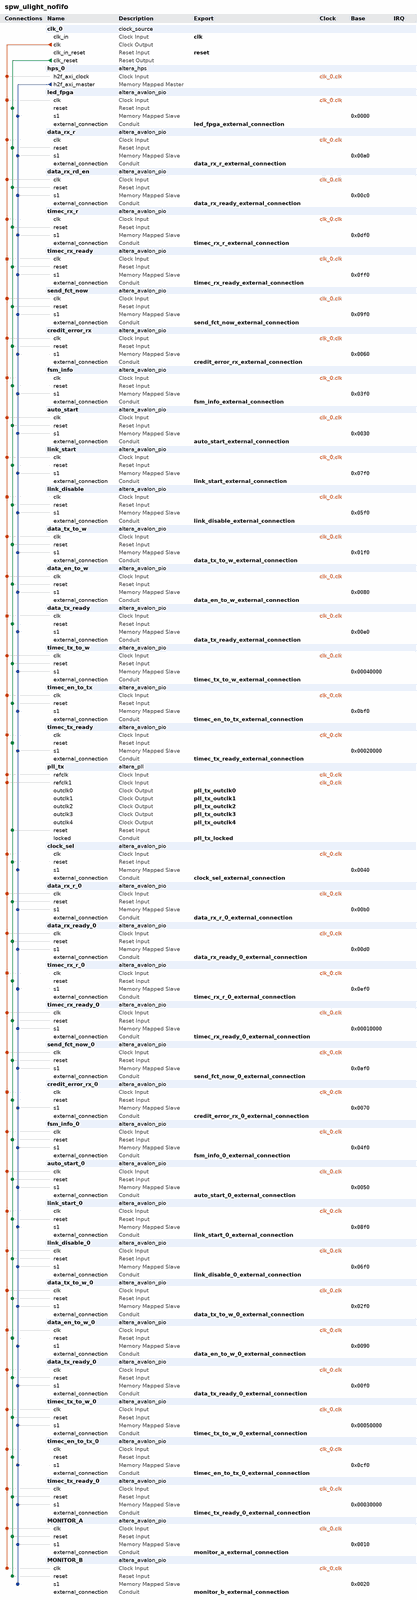
[diagram p0: system contents, whole]
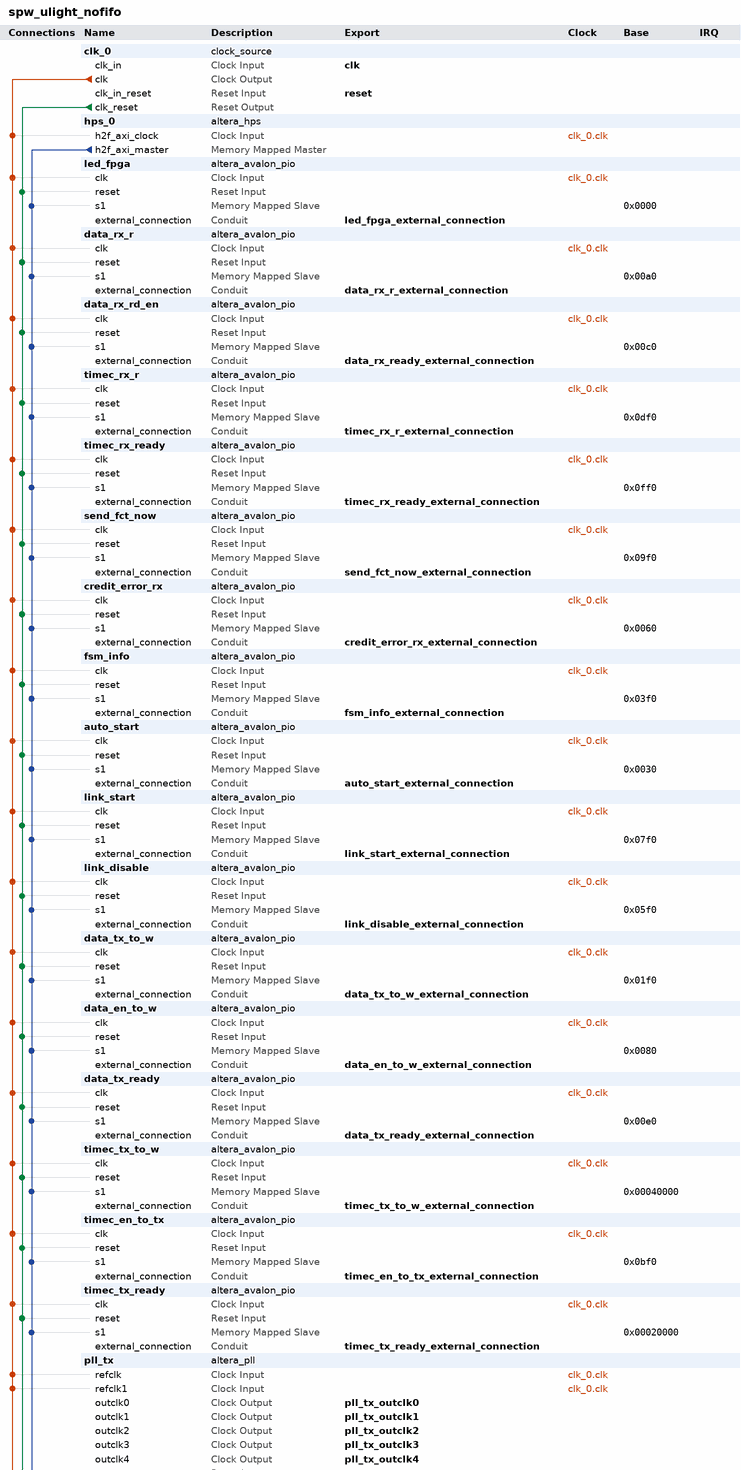
[diagram p1: system contents, upper part]
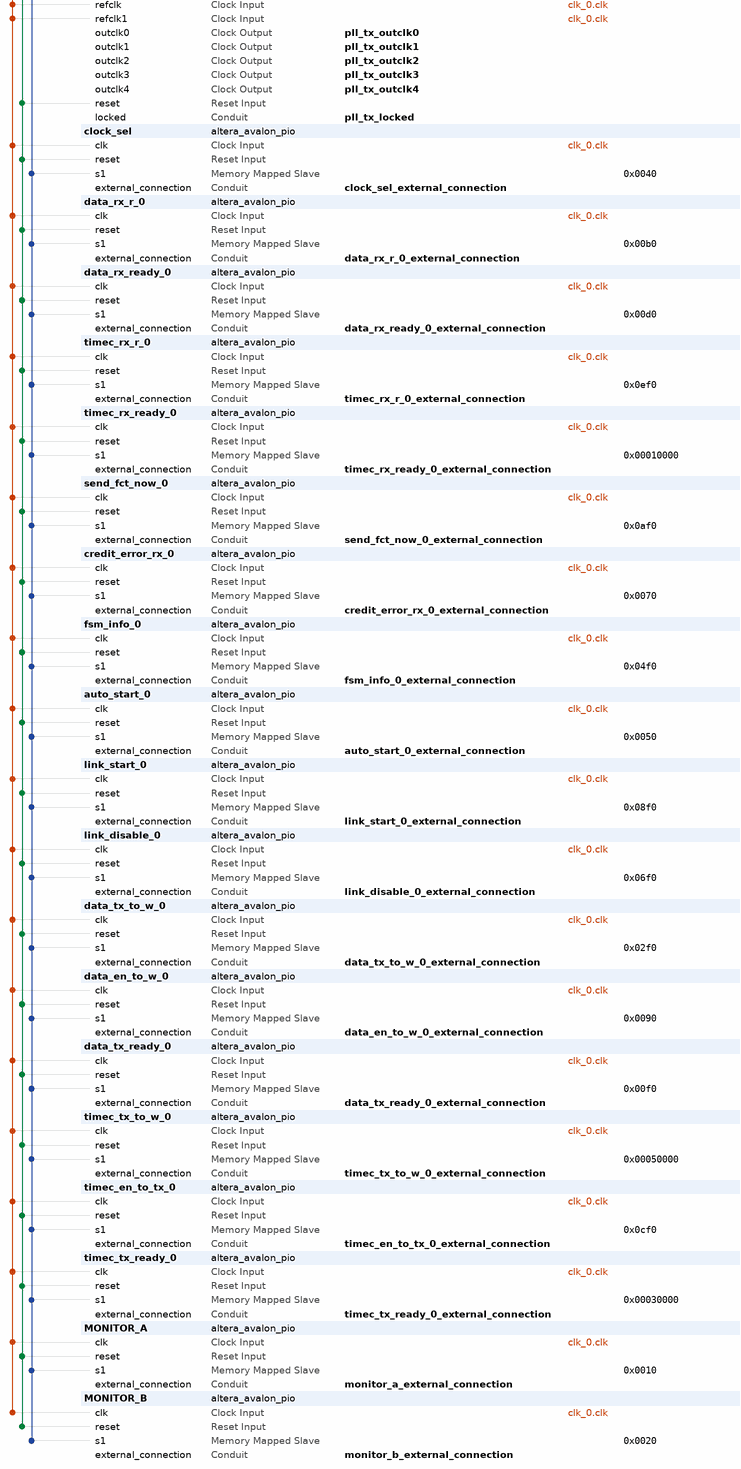
[diagram p2: system contents, lower part]
# Platform Designer (Qsys) system spw_ulight_nofifo, Cyclone V 5CSEMA4U23C6
# Parameters at their usual value, and those the tool derives, are not listed.
package require -exact qsys 17.0
create_system spw_ulight_nofifo
set_project_property DEVICE_FAMILY {Cyclone V}
set_project_property DEVICE 5CSEMA4U23C6

add_instance clk_0 clock_source 17.0
set_instance_parameter_value clk_0 clockFrequency 50000000

add_instance hps_0 altera_hps 17.0
set_instance_parameter_value hps_0 EMAC1_Mode N/A
set_instance_parameter_value hps_0 EMAC1_PinMuxing Unused
set_instance_parameter_value hps_0 F2SCLK_COLDRST_Enable false
set_instance_parameter_value hps_0 F2SCLK_DBGRST_Enable false
set_instance_parameter_value hps_0 F2SCLK_WARMRST_Enable false
set_instance_parameter_value hps_0 F2SINTERRUPT_Enable false
set_instance_parameter_value hps_0 F2S_Width 0
set_instance_parameter_value hps_0 FPGA_PERIPHERAL_OUTPUT_CLOCK_FREQ_EMAC0_GTX_CLK 125
set_instance_parameter_value hps_0 FPGA_PERIPHERAL_OUTPUT_CLOCK_FREQ_EMAC0_MD_CLK 2.5
set_instance_parameter_value hps_0 FPGA_PERIPHERAL_OUTPUT_CLOCK_FREQ_EMAC1_GTX_CLK 125
set_instance_parameter_value hps_0 FPGA_PERIPHERAL_OUTPUT_CLOCK_FREQ_EMAC1_MD_CLK 2.5
set_instance_parameter_value hps_0 HPS_PROTOCOL DDR3
set_instance_parameter_value hps_0 I2C0_Mode N/A
set_instance_parameter_value hps_0 I2C0_PinMuxing Unused
set_instance_parameter_value hps_0 I2C1_Mode N/A
set_instance_parameter_value hps_0 I2C1_PinMuxing Unused
set_instance_parameter_value hps_0 LWH2F_Enable false
set_instance_parameter_value hps_0 MEM_BANKADDR_WIDTH 3
set_instance_parameter_value hps_0 MEM_CLK_FREQ 300.0
set_instance_parameter_value hps_0 MEM_CLK_FREQ_MAX 400.0
set_instance_parameter_value hps_0 MEM_COL_ADDR_WIDTH 8
set_instance_parameter_value hps_0 MEM_DQ_WIDTH 8
set_instance_parameter_value hps_0 MEM_DRV_STR RZQ/6
set_instance_parameter_value hps_0 MEM_ROW_ADDR_WIDTH 12
set_instance_parameter_value hps_0 MEM_RTT_NOM {ODT Disabled}
set_instance_parameter_value hps_0 MEM_RTT_WR {Dynamic ODT off}
set_instance_parameter_value hps_0 MEM_TCL 7
set_instance_parameter_value hps_0 MEM_TFAW_NS 37.5
set_instance_parameter_value hps_0 MEM_TINIT_US 499
set_instance_parameter_value hps_0 MEM_TMRD_CK 3
set_instance_parameter_value hps_0 MEM_TRAS_NS 40.0
set_instance_parameter_value hps_0 MEM_TRCD_NS 15.0
set_instance_parameter_value hps_0 MEM_TREFI_US 7.0
set_instance_parameter_value hps_0 MEM_TRFC_NS 75.0
set_instance_parameter_value hps_0 MEM_TRP_NS 15.0
set_instance_parameter_value hps_0 MEM_TWTR 2
set_instance_parameter_value hps_0 MEM_VENDOR JEDEC
set_instance_parameter_value hps_0 MEM_WTCL 6
set_instance_parameter_value hps_0 QSPI_Mode N/A
set_instance_parameter_value hps_0 QSPI_PinMuxing Unused
set_instance_parameter_value hps_0 REF_CLK_FREQ 125.0
set_instance_parameter_value hps_0 S2FCLK_USER2CLK 5
set_instance_parameter_value hps_0 S2F_Width 1
set_instance_parameter_value hps_0 SDIO_Mode N/A
set_instance_parameter_value hps_0 SDIO_PinMuxing Unused
set_instance_parameter_value hps_0 SPIM1_Mode N/A
set_instance_parameter_value hps_0 SPIM1_PinMuxing Unused
set_instance_parameter_value hps_0 STM_Enable false
set_instance_parameter_value hps_0 TIMING_BOARD_AC_SKEW 0.02
set_instance_parameter_value hps_0 TIMING_BOARD_AC_TO_CK_SKEW 0.0
set_instance_parameter_value hps_0 TIMING_BOARD_DQ_TO_DQS_SKEW 0.0
set_instance_parameter_value hps_0 TIMING_BOARD_MAX_CK_DELAY 0.6
set_instance_parameter_value hps_0 TIMING_BOARD_MAX_DQS_DELAY 0.6
set_instance_parameter_value hps_0 TIMING_BOARD_SKEW_BETWEEN_DQS 0.02
set_instance_parameter_value hps_0 TIMING_BOARD_SKEW_CKDQS_DIMM_MAX 0.01
set_instance_parameter_value hps_0 TIMING_BOARD_SKEW_CKDQS_DIMM_MIN -0.01
set_instance_parameter_value hps_0 TIMING_BOARD_SKEW_WITHIN_DQS 0.02
set_instance_parameter_value hps_0 TIMING_TDH 125
set_instance_parameter_value hps_0 TIMING_TDQSCK 400
set_instance_parameter_value hps_0 TIMING_TDQSQ 120
set_instance_parameter_value hps_0 TIMING_TDS 50
set_instance_parameter_value hps_0 TIMING_TIH 250
set_instance_parameter_value hps_0 TIMING_TIS 175
set_instance_parameter_value hps_0 TIMING_TQSH 0.38
set_instance_parameter_value hps_0 UART0_Mode N/A
set_instance_parameter_value hps_0 UART0_PinMuxing Unused
set_instance_parameter_value hps_0 USB1_Mode N/A
set_instance_parameter_value hps_0 USB1_PinMuxing Unused
set_instance_parameter_value hps_0 desired_cfg_clk_mhz 100.0
set_instance_parameter_value hps_0 desired_qspi_clk_mhz 400.0
set_instance_parameter_value hps_0 eosc1_clk_mhz 50.0
set_instance_parameter_value hps_0 eosc2_clk_mhz 50.0

add_instance led_fpga altera_avalon_pio 17.0
set_instance_parameter_value led_fpga direction Output
set_instance_parameter_value led_fpga resetValue 1
set_instance_parameter_value led_fpga width 5

add_instance data_rx_r altera_avalon_pio 17.0
set_instance_parameter_value data_rx_r direction Input
set_instance_parameter_value data_rx_r width 9

add_instance data_rx_rd_en altera_avalon_pio 17.0
set_instance_parameter_value data_rx_rd_en direction Output
set_instance_parameter_value data_rx_rd_en width 1

add_instance timec_rx_r altera_avalon_pio 17.0
set_instance_parameter_value timec_rx_r direction Input
set_instance_parameter_value timec_rx_r width 8

add_instance timec_rx_ready altera_avalon_pio 17.0
set_instance_parameter_value timec_rx_ready direction Input
set_instance_parameter_value timec_rx_ready width 1

add_instance send_fct_now altera_avalon_pio 17.0
set_instance_parameter_value send_fct_now direction Output
set_instance_parameter_value send_fct_now width 1

add_instance credit_error_rx altera_avalon_pio 17.0
set_instance_parameter_value credit_error_rx direction Output
set_instance_parameter_value credit_error_rx width 1

add_instance fsm_info altera_avalon_pio 17.0
set_instance_parameter_value fsm_info direction Input
set_instance_parameter_value fsm_info width 6

add_instance auto_start altera_avalon_pio 17.0
set_instance_parameter_value auto_start direction Output
set_instance_parameter_value auto_start width 1

add_instance link_start altera_avalon_pio 17.0
set_instance_parameter_value link_start direction Output
set_instance_parameter_value link_start width 1

add_instance link_disable altera_avalon_pio 17.0
set_instance_parameter_value link_disable direction Output
set_instance_parameter_value link_disable width 1

add_instance data_tx_to_w altera_avalon_pio 17.0
set_instance_parameter_value data_tx_to_w direction Output
set_instance_parameter_value data_tx_to_w width 9

add_instance data_en_to_w altera_avalon_pio 17.0
set_instance_parameter_value data_en_to_w direction Output
set_instance_parameter_value data_en_to_w width 1

add_instance data_tx_ready altera_avalon_pio 17.0
set_instance_parameter_value data_tx_ready direction Input
set_instance_parameter_value data_tx_ready width 1

add_instance timec_tx_to_w altera_avalon_pio 17.0
set_instance_parameter_value timec_tx_to_w direction Output
set_instance_parameter_value timec_tx_to_w width 8

add_instance timec_en_to_tx altera_avalon_pio 17.0
set_instance_parameter_value timec_en_to_tx direction Output
set_instance_parameter_value timec_en_to_tx width 1

add_instance timec_tx_ready altera_avalon_pio 17.0
set_instance_parameter_value timec_tx_ready direction Input
set_instance_parameter_value timec_tx_ready width 1

add_instance pll_tx altera_pll 17.0
set_instance_parameter_value pll_tx gui_device_speed_grade 2
set_instance_parameter_value pll_tx gui_number_of_clocks 5
set_instance_parameter_value pll_tx gui_operation_mode direct
set_instance_parameter_value pll_tx gui_output_clock_frequency0 5.0
set_instance_parameter_value pll_tx gui_output_clock_frequency1 10.0
set_instance_parameter_value pll_tx gui_output_clock_frequency2 50.0
set_instance_parameter_value pll_tx gui_output_clock_frequency3 100.0
set_instance_parameter_value pll_tx gui_pll_mode {Integer-N PLL}
set_instance_parameter_value pll_tx gui_refclk_switch true
set_instance_parameter_value pll_tx gui_reference_clock_frequency 50.0
set_instance_parameter_value pll_tx gui_use_locked true

add_instance clock_sel altera_avalon_pio 17.0
set_instance_parameter_value clock_sel direction Output
set_instance_parameter_value clock_sel width 3

add_instance data_rx_r_0 altera_avalon_pio 17.0
set_instance_parameter_value data_rx_r_0 direction Input
set_instance_parameter_value data_rx_r_0 width 9

add_instance data_rx_ready_0 altera_avalon_pio 17.0
set_instance_parameter_value data_rx_ready_0 direction Input
set_instance_parameter_value data_rx_ready_0 width 1

add_instance timec_rx_r_0 altera_avalon_pio 17.0
set_instance_parameter_value timec_rx_r_0 direction Input
set_instance_parameter_value timec_rx_r_0 width 8

add_instance timec_rx_ready_0 altera_avalon_pio 17.0
set_instance_parameter_value timec_rx_ready_0 direction Input
set_instance_parameter_value timec_rx_ready_0 width 1

add_instance send_fct_now_0 altera_avalon_pio 17.0
set_instance_parameter_value send_fct_now_0 direction Output
set_instance_parameter_value send_fct_now_0 width 1

add_instance credit_error_rx_0 altera_avalon_pio 17.0
set_instance_parameter_value credit_error_rx_0 direction Output
set_instance_parameter_value credit_error_rx_0 width 1

add_instance fsm_info_0 altera_avalon_pio 17.0
set_instance_parameter_value fsm_info_0 direction Input
set_instance_parameter_value fsm_info_0 width 6

add_instance auto_start_0 altera_avalon_pio 17.0
set_instance_parameter_value auto_start_0 direction Output
set_instance_parameter_value auto_start_0 width 1

add_instance link_start_0 altera_avalon_pio 17.0
set_instance_parameter_value link_start_0 direction Output
set_instance_parameter_value link_start_0 width 1

add_instance link_disable_0 altera_avalon_pio 17.0
set_instance_parameter_value link_disable_0 direction Output
set_instance_parameter_value link_disable_0 width 1

add_instance data_tx_to_w_0 altera_avalon_pio 17.0
set_instance_parameter_value data_tx_to_w_0 direction Output
set_instance_parameter_value data_tx_to_w_0 width 9

add_instance data_en_to_w_0 altera_avalon_pio 17.0
set_instance_parameter_value data_en_to_w_0 direction Output
set_instance_parameter_value data_en_to_w_0 width 1

add_instance data_tx_ready_0 altera_avalon_pio 17.0
set_instance_parameter_value data_tx_ready_0 direction Input
set_instance_parameter_value data_tx_ready_0 width 1

add_instance timec_tx_to_w_0 altera_avalon_pio 17.0
set_instance_parameter_value timec_tx_to_w_0 direction Output
set_instance_parameter_value timec_tx_to_w_0 width 8

add_instance timec_en_to_tx_0 altera_avalon_pio 17.0
set_instance_parameter_value timec_en_to_tx_0 direction Output
set_instance_parameter_value timec_en_to_tx_0 width 1

add_instance timec_tx_ready_0 altera_avalon_pio 17.0
set_instance_parameter_value timec_tx_ready_0 direction Input
set_instance_parameter_value timec_tx_ready_0 width 1

add_instance MONITOR_A altera_avalon_pio 17.0
set_instance_parameter_value MONITOR_A direction Input
set_instance_parameter_value MONITOR_A width 14

add_instance MONITOR_B altera_avalon_pio 17.0
set_instance_parameter_value MONITOR_B direction Input
set_instance_parameter_value MONITOR_B width 14

# connections
add_connection clk_0.clk auto_start.clk clock
add_connection clk_0.clk auto_start_0.clk clock
add_connection clk_0.clk clock_sel.clk clock
add_connection clk_0.clk credit_error_rx.clk clock
add_connection clk_0.clk credit_error_rx_0.clk clock
add_connection clk_0.clk data_en_to_w.clk clock
add_connection clk_0.clk data_en_to_w_0.clk clock
add_connection clk_0.clk data_rx_r.clk clock
add_connection clk_0.clk data_rx_r_0.clk clock
add_connection clk_0.clk data_rx_rd_en.clk clock
add_connection clk_0.clk data_rx_ready_0.clk clock
add_connection clk_0.clk data_tx_ready.clk clock
add_connection clk_0.clk data_tx_ready_0.clk clock
add_connection clk_0.clk data_tx_to_w.clk clock
add_connection clk_0.clk data_tx_to_w_0.clk clock
add_connection clk_0.clk fsm_info.clk clock
add_connection clk_0.clk fsm_info_0.clk clock
add_connection clk_0.clk hps_0.h2f_axi_clock clock
add_connection clk_0.clk led_fpga.clk clock
add_connection clk_0.clk link_disable.clk clock
add_connection clk_0.clk link_disable_0.clk clock
add_connection clk_0.clk link_start.clk clock
add_connection clk_0.clk link_start_0.clk clock
add_connection clk_0.clk MONITOR_A.clk clock
add_connection clk_0.clk MONITOR_B.clk clock
add_connection clk_0.clk pll_tx.refclk clock
add_connection clk_0.clk pll_tx.refclk1 clock
add_connection clk_0.clk send_fct_now.clk clock
add_connection clk_0.clk send_fct_now_0.clk clock
add_connection clk_0.clk timec_en_to_tx.clk clock
add_connection clk_0.clk timec_en_to_tx_0.clk clock
add_connection clk_0.clk timec_rx_r.clk clock
add_connection clk_0.clk timec_rx_r_0.clk clock
add_connection clk_0.clk timec_rx_ready.clk clock
add_connection clk_0.clk timec_rx_ready_0.clk clock
add_connection clk_0.clk timec_tx_ready.clk clock
add_connection clk_0.clk timec_tx_ready_0.clk clock
add_connection clk_0.clk timec_tx_to_w.clk clock
add_connection clk_0.clk timec_tx_to_w_0.clk clock
add_connection clk_0.clk_reset auto_start.reset reset
add_connection clk_0.clk_reset auto_start_0.reset reset
add_connection clk_0.clk_reset clock_sel.reset reset
add_connection clk_0.clk_reset credit_error_rx.reset reset
add_connection clk_0.clk_reset credit_error_rx_0.reset reset
add_connection clk_0.clk_reset data_en_to_w.reset reset
add_connection clk_0.clk_reset data_en_to_w_0.reset reset
add_connection clk_0.clk_reset data_rx_r.reset reset
add_connection clk_0.clk_reset data_rx_r_0.reset reset
add_connection clk_0.clk_reset data_rx_rd_en.reset reset
add_connection clk_0.clk_reset data_rx_ready_0.reset reset
add_connection clk_0.clk_reset data_tx_ready.reset reset
add_connection clk_0.clk_reset data_tx_ready_0.reset reset
add_connection clk_0.clk_reset data_tx_to_w.reset reset
add_connection clk_0.clk_reset data_tx_to_w_0.reset reset
add_connection clk_0.clk_reset fsm_info.reset reset
add_connection clk_0.clk_reset fsm_info_0.reset reset
add_connection clk_0.clk_reset led_fpga.reset reset
add_connection clk_0.clk_reset link_disable.reset reset
add_connection clk_0.clk_reset link_disable_0.reset reset
add_connection clk_0.clk_reset link_start.reset reset
add_connection clk_0.clk_reset link_start_0.reset reset
add_connection clk_0.clk_reset MONITOR_A.reset reset
add_connection clk_0.clk_reset MONITOR_B.reset reset
add_connection clk_0.clk_reset pll_tx.reset reset
add_connection clk_0.clk_reset send_fct_now.reset reset
add_connection clk_0.clk_reset send_fct_now_0.reset reset
add_connection clk_0.clk_reset timec_en_to_tx.reset reset
add_connection clk_0.clk_reset timec_en_to_tx_0.reset reset
add_connection clk_0.clk_reset timec_rx_r.reset reset
add_connection clk_0.clk_reset timec_rx_r_0.reset reset
add_connection clk_0.clk_reset timec_rx_ready.reset reset
add_connection clk_0.clk_reset timec_rx_ready_0.reset reset
add_connection clk_0.clk_reset timec_tx_ready.reset reset
add_connection clk_0.clk_reset timec_tx_ready_0.reset reset
add_connection clk_0.clk_reset timec_tx_to_w.reset reset
add_connection clk_0.clk_reset timec_tx_to_w_0.reset reset
add_connection hps_0.h2f_axi_master auto_start.s1 avalon
set_connection_parameter_value hps_0.h2f_axi_master/auto_start.s1 baseAddress 0x0030
add_connection hps_0.h2f_axi_master auto_start_0.s1 avalon
set_connection_parameter_value hps_0.h2f_axi_master/auto_start_0.s1 baseAddress 0x0050
add_connection hps_0.h2f_axi_master clock_sel.s1 avalon
set_connection_parameter_value hps_0.h2f_axi_master/clock_sel.s1 baseAddress 0x0040
add_connection hps_0.h2f_axi_master credit_error_rx.s1 avalon
set_connection_parameter_value hps_0.h2f_axi_master/credit_error_rx.s1 baseAddress 0x0060
add_connection hps_0.h2f_axi_master credit_error_rx_0.s1 avalon
set_connection_parameter_value hps_0.h2f_axi_master/credit_error_rx_0.s1 baseAddress 0x0070
add_connection hps_0.h2f_axi_master data_en_to_w.s1 avalon
set_connection_parameter_value hps_0.h2f_axi_master/data_en_to_w.s1 baseAddress 0x0080
add_connection hps_0.h2f_axi_master data_en_to_w_0.s1 avalon
set_connection_parameter_value hps_0.h2f_axi_master/data_en_to_w_0.s1 baseAddress 0x0090
add_connection hps_0.h2f_axi_master data_rx_r.s1 avalon
set_connection_parameter_value hps_0.h2f_axi_master/data_rx_r.s1 baseAddress 0x00a0
add_connection hps_0.h2f_axi_master data_rx_r_0.s1 avalon
set_connection_parameter_value hps_0.h2f_axi_master/data_rx_r_0.s1 baseAddress 0x00b0
add_connection hps_0.h2f_axi_master data_rx_rd_en.s1 avalon
set_connection_parameter_value hps_0.h2f_axi_master/data_rx_rd_en.s1 baseAddress 0x00c0
add_connection hps_0.h2f_axi_master data_rx_ready_0.s1 avalon
set_connection_parameter_value hps_0.h2f_axi_master/data_rx_ready_0.s1 baseAddress 0x00d0
add_connection hps_0.h2f_axi_master data_tx_ready.s1 avalon
set_connection_parameter_value hps_0.h2f_axi_master/data_tx_ready.s1 baseAddress 0x00e0
add_connection hps_0.h2f_axi_master data_tx_ready_0.s1 avalon
set_connection_parameter_value hps_0.h2f_axi_master/data_tx_ready_0.s1 baseAddress 0x00f0
add_connection hps_0.h2f_axi_master data_tx_to_w.s1 avalon
set_connection_parameter_value hps_0.h2f_axi_master/data_tx_to_w.s1 baseAddress 0x01f0
add_connection hps_0.h2f_axi_master data_tx_to_w_0.s1 avalon
set_connection_parameter_value hps_0.h2f_axi_master/data_tx_to_w_0.s1 baseAddress 0x02f0
add_connection hps_0.h2f_axi_master fsm_info.s1 avalon
set_connection_parameter_value hps_0.h2f_axi_master/fsm_info.s1 baseAddress 0x03f0
add_connection hps_0.h2f_axi_master fsm_info_0.s1 avalon
set_connection_parameter_value hps_0.h2f_axi_master/fsm_info_0.s1 baseAddress 0x04f0
add_connection hps_0.h2f_axi_master led_fpga.s1 avalon
set_connection_parameter_value hps_0.h2f_axi_master/led_fpga.s1 baseAddress 0x0000
add_connection hps_0.h2f_axi_master link_disable.s1 avalon
set_connection_parameter_value hps_0.h2f_axi_master/link_disable.s1 baseAddress 0x05f0
add_connection hps_0.h2f_axi_master link_disable_0.s1 avalon
set_connection_parameter_value hps_0.h2f_axi_master/link_disable_0.s1 baseAddress 0x06f0
add_connection hps_0.h2f_axi_master link_start.s1 avalon
set_connection_parameter_value hps_0.h2f_axi_master/link_start.s1 baseAddress 0x07f0
add_connection hps_0.h2f_axi_master link_start_0.s1 avalon
set_connection_parameter_value hps_0.h2f_axi_master/link_start_0.s1 baseAddress 0x08f0
add_connection hps_0.h2f_axi_master MONITOR_A.s1 avalon
set_connection_parameter_value hps_0.h2f_axi_master/MONITOR_A.s1 baseAddress 0x0010
add_connection hps_0.h2f_axi_master MONITOR_B.s1 avalon
set_connection_parameter_value hps_0.h2f_axi_master/MONITOR_B.s1 baseAddress 0x0020
add_connection hps_0.h2f_axi_master send_fct_now.s1 avalon
set_connection_parameter_value hps_0.h2f_axi_master/send_fct_now.s1 baseAddress 0x09f0
add_connection hps_0.h2f_axi_master send_fct_now_0.s1 avalon
set_connection_parameter_value hps_0.h2f_axi_master/send_fct_now_0.s1 baseAddress 0x0af0
add_connection hps_0.h2f_axi_master timec_en_to_tx.s1 avalon
set_connection_parameter_value hps_0.h2f_axi_master/timec_en_to_tx.s1 baseAddress 0x0bf0
add_connection hps_0.h2f_axi_master timec_en_to_tx_0.s1 avalon
set_connection_parameter_value hps_0.h2f_axi_master/timec_en_to_tx_0.s1 baseAddress 0x0cf0
add_connection hps_0.h2f_axi_master timec_rx_r.s1 avalon
set_connection_parameter_value hps_0.h2f_axi_master/timec_rx_r.s1 baseAddress 0x0df0
add_connection hps_0.h2f_axi_master timec_rx_r_0.s1 avalon
set_connection_parameter_value hps_0.h2f_axi_master/timec_rx_r_0.s1 baseAddress 0x0ef0
add_connection hps_0.h2f_axi_master timec_rx_ready.s1 avalon
set_connection_parameter_value hps_0.h2f_axi_master/timec_rx_ready.s1 baseAddress 0x0ff0
add_connection hps_0.h2f_axi_master timec_rx_ready_0.s1 avalon
set_connection_parameter_value hps_0.h2f_axi_master/timec_rx_ready_0.s1 baseAddress 0x00010000
add_connection hps_0.h2f_axi_master timec_tx_ready.s1 avalon
set_connection_parameter_value hps_0.h2f_axi_master/timec_tx_ready.s1 baseAddress 0x00020000
add_connection hps_0.h2f_axi_master timec_tx_ready_0.s1 avalon
set_connection_parameter_value hps_0.h2f_axi_master/timec_tx_ready_0.s1 baseAddress 0x00030000
add_connection hps_0.h2f_axi_master timec_tx_to_w.s1 avalon
set_connection_parameter_value hps_0.h2f_axi_master/timec_tx_to_w.s1 baseAddress 0x00040000
add_connection hps_0.h2f_axi_master timec_tx_to_w_0.s1 avalon
set_connection_parameter_value hps_0.h2f_axi_master/timec_tx_to_w_0.s1 baseAddress 0x00050000

# exported interfaces
add_interface auto_start_0_external_connection conduit end
set_interface_property auto_start_0_external_connection EXPORT_OF auto_start_0.external_connection
add_interface auto_start_external_connection conduit end
set_interface_property auto_start_external_connection EXPORT_OF auto_start.external_connection
add_interface clk clock sink
set_interface_property clk EXPORT_OF clk_0.clk_in
add_interface clock_sel_external_connection conduit end
set_interface_property clock_sel_external_connection EXPORT_OF clock_sel.external_connection
add_interface credit_error_rx_0_external_connection conduit end
set_interface_property credit_error_rx_0_external_connection EXPORT_OF credit_error_rx_0.external_connection
add_interface credit_error_rx_external_connection conduit end
set_interface_property credit_error_rx_external_connection EXPORT_OF credit_error_rx.external_connection
add_interface data_en_to_w_0_external_connection conduit end
set_interface_property data_en_to_w_0_external_connection EXPORT_OF data_en_to_w_0.external_connection
add_interface data_en_to_w_external_connection conduit end
set_interface_property data_en_to_w_external_connection EXPORT_OF data_en_to_w.external_connection
add_interface data_rx_r_0_external_connection conduit end
set_interface_property data_rx_r_0_external_connection EXPORT_OF data_rx_r_0.external_connection
add_interface data_rx_r_external_connection conduit end
set_interface_property data_rx_r_external_connection EXPORT_OF data_rx_r.external_connection
add_interface data_rx_ready_0_external_connection conduit end
set_interface_property data_rx_ready_0_external_connection EXPORT_OF data_rx_ready_0.external_connection
add_interface data_rx_ready_external_connection conduit end
set_interface_property data_rx_ready_external_connection EXPORT_OF data_rx_rd_en.external_connection
add_interface data_tx_ready_0_external_connection conduit end
set_interface_property data_tx_ready_0_external_connection EXPORT_OF data_tx_ready_0.external_connection
add_interface data_tx_ready_external_connection conduit end
set_interface_property data_tx_ready_external_connection EXPORT_OF data_tx_ready.external_connection
add_interface data_tx_to_w_0_external_connection conduit end
set_interface_property data_tx_to_w_0_external_connection EXPORT_OF data_tx_to_w_0.external_connection
add_interface data_tx_to_w_external_connection conduit end
set_interface_property data_tx_to_w_external_connection EXPORT_OF data_tx_to_w.external_connection
add_interface fsm_info_0_external_connection conduit end
set_interface_property fsm_info_0_external_connection EXPORT_OF fsm_info_0.external_connection
add_interface fsm_info_external_connection conduit end
set_interface_property fsm_info_external_connection EXPORT_OF fsm_info.external_connection
add_interface led_fpga_external_connection conduit end
set_interface_property led_fpga_external_connection EXPORT_OF led_fpga.external_connection
add_interface link_disable_0_external_connection conduit end
set_interface_property link_disable_0_external_connection EXPORT_OF link_disable_0.external_connection
add_interface link_disable_external_connection conduit end
set_interface_property link_disable_external_connection EXPORT_OF link_disable.external_connection
add_interface link_start_0_external_connection conduit end
set_interface_property link_start_0_external_connection EXPORT_OF link_start_0.external_connection
add_interface link_start_external_connection conduit end
set_interface_property link_start_external_connection EXPORT_OF link_start.external_connection
add_interface monitor_a_external_connection conduit end
set_interface_property monitor_a_external_connection EXPORT_OF MONITOR_A.external_connection
add_interface monitor_b_external_connection conduit end
set_interface_property monitor_b_external_connection EXPORT_OF MONITOR_B.external_connection
add_interface pll_tx_locked conduit end
set_interface_property pll_tx_locked EXPORT_OF pll_tx.locked
add_interface pll_tx_outclk0 clock source
set_interface_property pll_tx_outclk0 EXPORT_OF pll_tx.outclk0
add_interface pll_tx_outclk1 clock source
set_interface_property pll_tx_outclk1 EXPORT_OF pll_tx.outclk1
add_interface pll_tx_outclk2 clock source
set_interface_property pll_tx_outclk2 EXPORT_OF pll_tx.outclk2
add_interface pll_tx_outclk3 clock source
set_interface_property pll_tx_outclk3 EXPORT_OF pll_tx.outclk3
add_interface pll_tx_outclk4 clock source
set_interface_property pll_tx_outclk4 EXPORT_OF pll_tx.outclk4
add_interface reset reset sink
set_interface_property reset EXPORT_OF clk_0.clk_in_reset
add_interface send_fct_now_0_external_connection conduit end
set_interface_property send_fct_now_0_external_connection EXPORT_OF send_fct_now_0.external_connection
add_interface send_fct_now_external_connection conduit end
set_interface_property send_fct_now_external_connection EXPORT_OF send_fct_now.external_connection
add_interface timec_en_to_tx_0_external_connection conduit end
set_interface_property timec_en_to_tx_0_external_connection EXPORT_OF timec_en_to_tx_0.external_connection
add_interface timec_en_to_tx_external_connection conduit end
set_interface_property timec_en_to_tx_external_connection EXPORT_OF timec_en_to_tx.external_connection
add_interface timec_rx_r_0_external_connection conduit end
set_interface_property timec_rx_r_0_external_connection EXPORT_OF timec_rx_r_0.external_connection
add_interface timec_rx_r_external_connection conduit end
set_interface_property timec_rx_r_external_connection EXPORT_OF timec_rx_r.external_connection
add_interface timec_rx_ready_0_external_connection conduit end
set_interface_property timec_rx_ready_0_external_connection EXPORT_OF timec_rx_ready_0.external_connection
add_interface timec_rx_ready_external_connection conduit end
set_interface_property timec_rx_ready_external_connection EXPORT_OF timec_rx_ready.external_connection
add_interface timec_tx_ready_0_external_connection conduit end
set_interface_property timec_tx_ready_0_external_connection EXPORT_OF timec_tx_ready_0.external_connection
add_interface timec_tx_ready_external_connection conduit end
set_interface_property timec_tx_ready_external_connection EXPORT_OF timec_tx_ready.external_connection
add_interface timec_tx_to_w_0_external_connection conduit end
set_interface_property timec_tx_to_w_0_external_connection EXPORT_OF timec_tx_to_w_0.external_connection
add_interface timec_tx_to_w_external_connection conduit end
set_interface_property timec_tx_to_w_external_connection EXPORT_OF timec_tx_to_w.external_connection

set_interconnect_requirement {$system} qsys_mm.clockCrossingAdapter AUTO
set_interconnect_requirement {$system} qsys_mm.enableEccProtection FALSE
set_interconnect_requirement {$system} qsys_mm.insertDefaultSlave FALSE
set_interconnect_requirement {$system} qsys_mm.maxAdditionalLatency 1

save_system spw_ulight_nofifo.qsys
